# Altium schematic sheet Sheet2.SchDoc
size A4
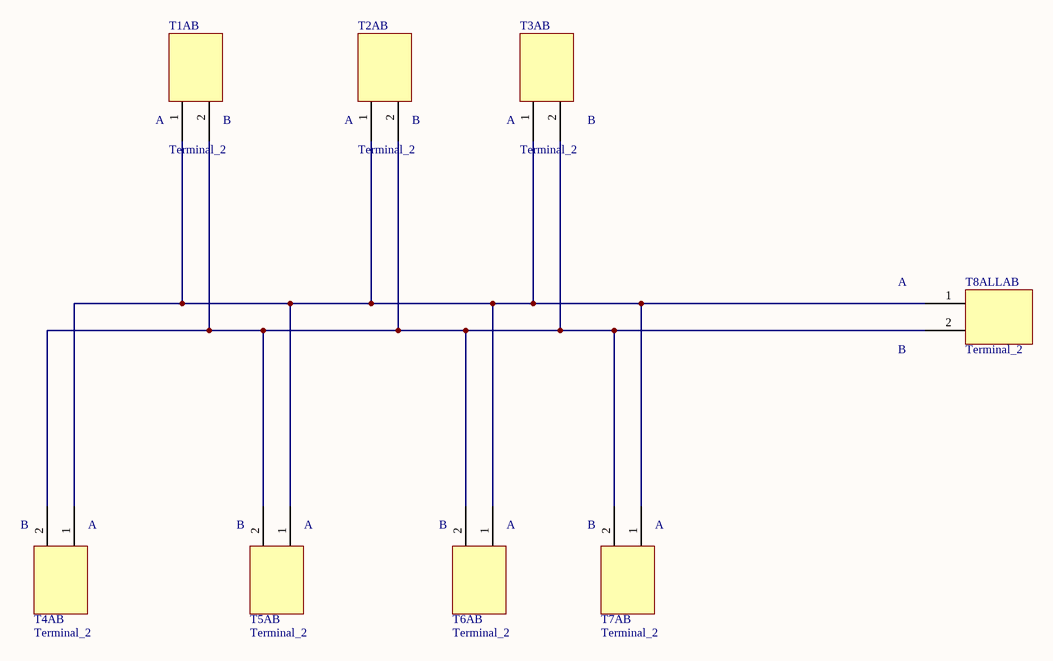
[diagram p0: Sheet2.SchDoc]

## Parts
T1AB  Terminal_2  [TERMINAL_2_3.5]
T2AB  Terminal_2  [TERMINAL_2_3.5]
T3AB  Terminal_2  [TERMINAL_2_3.5]
T4AB  Terminal_2  [TERMINAL_2_3.5]
T5AB  Terminal_2  [TERMINAL_2_3.5]
T6AB  Terminal_2  [TERMINAL_2_3.5]
T7AB  Terminal_2  [TERMINAL_2_3.5]
T8ALLAB  Terminal_2  [TERMINAL_2_3.5]

## Nets
NetT1AB_1: T1AB.1 T2AB.1 T3AB.1 T4AB.1 T5AB.1 T6AB.1 T7AB.1 T8ALLAB.1
NetT1AB_2: T1AB.2 T2AB.2 T3AB.2 T4AB.2 T5AB.2 T6AB.2 T7AB.2 T8ALLAB.2

## Notes on the sheet
- (near T1AB) A
- (near T1AB) B
- (near T2AB) A
- (near T2AB) B
- (near T3AB) A
- (near T3AB) B
- A
- B
- (near T4AB) B
- (near T4AB) A
- (near T5AB) B
- (near T5AB) A
- (near T6AB) B
- (near T6AB) A
- (near T7AB) B
- (near T7AB) A